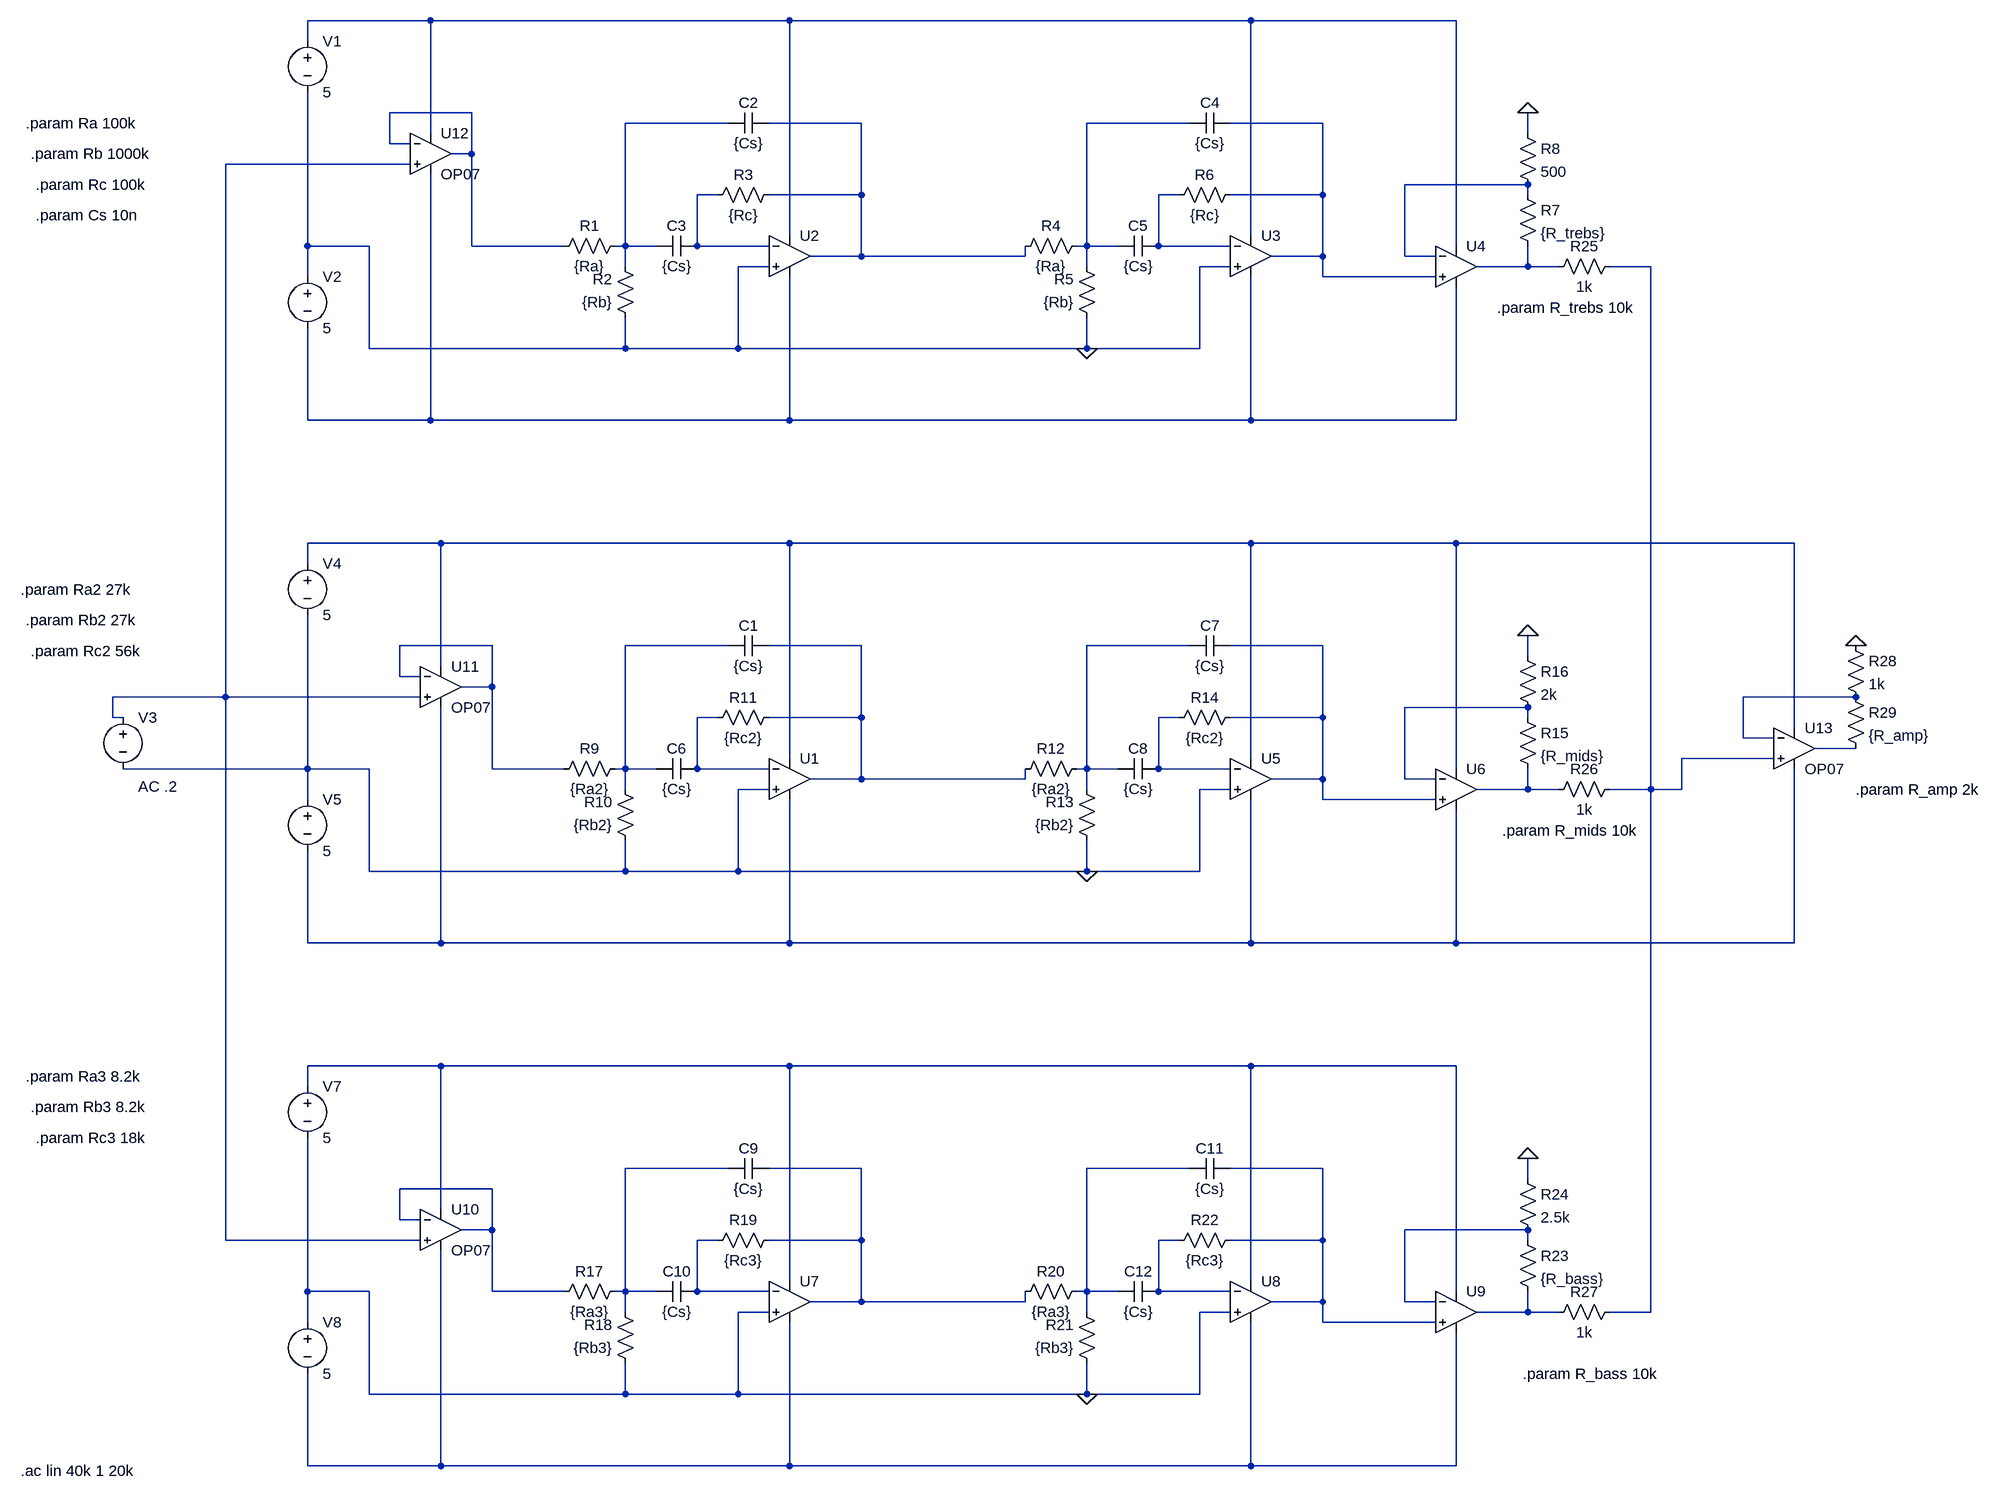
[diagram p0: schematic MFB_3_stages.asc]
MFB_3_stages.asc, the LTspice schematic file:
Version 4
SHEET 1 1616 2616
WIRE -816 320 -1008 320
WIRE -256 320 -816 320
WIRE 464 320 -256 320
WIRE 784 320 464 320
WIRE -1008 352 -1008 320
WIRE -752 464 -880 464
WIRE -352 480 -512 480
WIRE -144 480 -288 480
WIRE 368 480 208 480
WIRE 576 480 432 480
WIRE -816 496 -816 320
WIRE 896 496 896 464
WIRE -880 512 -880 464
WIRE -848 512 -880 512
WIRE -752 528 -752 464
WIRE -752 528 -784 528
WIRE -848 544 -1136 544
WIRE 896 576 704 576
WIRE -368 592 -400 592
WIRE -144 592 -144 480
WIRE -144 592 -288 592
WIRE 352 592 320 592
WIRE 576 592 576 480
WIRE 576 592 432 592
WIRE 896 592 896 576
WIRE -256 656 -256 320
WIRE 464 656 464 320
WIRE -1008 672 -1008 432
WIRE -912 672 -1008 672
WIRE -752 672 -752 528
WIRE -608 672 -752 672
WIRE -512 672 -512 480
WIRE -512 672 -528 672
WIRE -464 672 -512 672
WIRE -400 672 -400 592
WIRE -288 672 -400 672
WIRE 208 672 208 480
WIRE 208 672 192 672
WIRE 256 672 208 672
WIRE 320 672 320 592
WIRE 432 672 320 672
WIRE 784 672 784 320
WIRE -144 688 -144 592
WIRE -144 688 -224 688
WIRE 112 688 112 672
WIRE 112 688 -144 688
WIRE 576 688 576 592
WIRE 576 688 496 688
WIRE 704 688 704 576
WIRE 752 688 704 688
WIRE -512 704 -512 672
WIRE -288 704 -336 704
WIRE 208 704 208 672
WIRE 432 704 384 704
WIRE 896 704 896 672
WIRE 896 704 816 704
WIRE 944 704 896 704
WIRE 1088 704 1024 704
WIRE -1008 720 -1008 672
WIRE 576 720 576 688
WIRE 752 720 576 720
WIRE -912 832 -912 672
WIRE -512 832 -512 784
WIRE -512 832 -912 832
WIRE -336 832 -336 704
WIRE -336 832 -512 832
WIRE 208 832 208 784
WIRE 208 832 -336 832
WIRE 384 832 384 704
WIRE 384 832 208 832
WIRE -1008 944 -1008 800
WIRE -816 944 -816 560
WIRE -816 944 -1008 944
WIRE -256 944 -256 720
WIRE -256 944 -816 944
WIRE 464 944 464 720
WIRE 464 944 -256 944
WIRE 784 944 784 736
WIRE 784 944 464 944
WIRE -800 1136 -1008 1136
WIRE -256 1136 -800 1136
WIRE 464 1136 -256 1136
WIRE 784 1136 464 1136
WIRE 1312 1136 784 1136
WIRE -1008 1168 -1008 1136
WIRE -720 1296 -864 1296
WIRE -352 1296 -512 1296
WIRE -144 1296 -288 1296
WIRE 368 1296 208 1296
WIRE 576 1296 432 1296
WIRE 896 1312 896 1280
WIRE -800 1328 -800 1136
WIRE -864 1344 -864 1296
WIRE -832 1344 -864 1344
WIRE -720 1360 -720 1296
WIRE -720 1360 -768 1360
WIRE -1136 1376 -1136 544
WIRE -1136 1376 -1312 1376
WIRE -832 1376 -1136 1376
WIRE 1408 1376 1232 1376
WIRE 896 1392 704 1392
WIRE -1312 1408 -1312 1376
WIRE -1296 1408 -1312 1408
WIRE -368 1408 -400 1408
WIRE -144 1408 -144 1296
WIRE -144 1408 -288 1408
WIRE 352 1408 320 1408
WIRE 576 1408 576 1296
WIRE 576 1408 432 1408
WIRE 896 1408 896 1392
WIRE 1312 1424 1312 1136
WIRE 1232 1440 1232 1376
WIRE 1280 1440 1232 1440
WIRE 1408 1456 1344 1456
WIRE -256 1472 -256 1136
WIRE 464 1472 464 1136
WIRE 1280 1472 1136 1472
WIRE -1008 1488 -1008 1248
WIRE -1008 1488 -1296 1488
WIRE -912 1488 -1008 1488
WIRE -720 1488 -720 1360
WIRE -608 1488 -720 1488
WIRE -512 1488 -512 1296
WIRE -512 1488 -528 1488
WIRE -464 1488 -512 1488
WIRE -400 1488 -400 1408
WIRE -288 1488 -400 1488
WIRE 208 1488 208 1296
WIRE 208 1488 192 1488
WIRE 256 1488 208 1488
WIRE 320 1488 320 1408
WIRE 432 1488 320 1488
WIRE 784 1488 784 1136
WIRE -144 1504 -144 1408
WIRE -144 1504 -224 1504
WIRE 112 1504 112 1488
WIRE 112 1504 -144 1504
WIRE 576 1504 576 1408
WIRE 576 1504 496 1504
WIRE 704 1504 704 1392
WIRE 752 1504 704 1504
WIRE -512 1520 -512 1488
WIRE -288 1520 -336 1520
WIRE 208 1520 208 1488
WIRE 432 1520 384 1520
WIRE 896 1520 896 1488
WIRE 896 1520 816 1520
WIRE 944 1520 896 1520
WIRE 1088 1520 1088 704
WIRE 1088 1520 1024 1520
WIRE 1136 1520 1136 1472
WIRE 1136 1520 1088 1520
WIRE -1008 1536 -1008 1488
WIRE 576 1536 576 1504
WIRE 752 1536 576 1536
WIRE -912 1648 -912 1488
WIRE -512 1648 -512 1600
WIRE -512 1648 -912 1648
WIRE -336 1648 -336 1520
WIRE -336 1648 -512 1648
WIRE 208 1648 208 1600
WIRE 208 1648 -336 1648
WIRE 384 1648 384 1520
WIRE 384 1648 208 1648
WIRE -1008 1760 -1008 1616
WIRE -800 1760 -800 1392
WIRE -800 1760 -1008 1760
WIRE -256 1760 -256 1536
WIRE -256 1760 -800 1760
WIRE 464 1760 464 1536
WIRE 464 1760 -256 1760
WIRE 784 1760 784 1552
WIRE 784 1760 464 1760
WIRE 1312 1760 1312 1488
WIRE 1312 1760 784 1760
WIRE -800 1952 -1008 1952
WIRE -256 1952 -800 1952
WIRE 464 1952 -256 1952
WIRE 784 1952 464 1952
WIRE -1008 1984 -1008 1952
WIRE -352 2112 -512 2112
WIRE -144 2112 -288 2112
WIRE 368 2112 208 2112
WIRE 576 2112 432 2112
WIRE 896 2128 896 2096
WIRE -720 2144 -864 2144
WIRE -800 2176 -800 1952
WIRE -864 2192 -864 2144
WIRE -832 2192 -864 2192
WIRE -720 2208 -720 2144
WIRE -720 2208 -768 2208
WIRE 896 2208 704 2208
WIRE -1136 2224 -1136 1376
WIRE -832 2224 -1136 2224
WIRE -368 2224 -400 2224
WIRE -144 2224 -144 2112
WIRE -144 2224 -288 2224
WIRE 352 2224 320 2224
WIRE 576 2224 576 2112
WIRE 576 2224 432 2224
WIRE 896 2224 896 2208
WIRE -256 2288 -256 1952
WIRE 464 2288 464 1952
WIRE -1008 2304 -1008 2064
WIRE -912 2304 -1008 2304
WIRE -720 2304 -720 2208
WIRE -608 2304 -720 2304
WIRE -512 2304 -512 2112
WIRE -512 2304 -528 2304
WIRE -464 2304 -512 2304
WIRE -400 2304 -400 2224
WIRE -288 2304 -400 2304
WIRE 208 2304 208 2112
WIRE 208 2304 192 2304
WIRE 256 2304 208 2304
WIRE 320 2304 320 2224
WIRE 432 2304 320 2304
WIRE 784 2304 784 1952
WIRE -144 2320 -144 2224
WIRE -144 2320 -224 2320
WIRE 112 2320 112 2304
WIRE 112 2320 -144 2320
WIRE 576 2320 576 2224
WIRE 576 2320 496 2320
WIRE 704 2320 704 2208
WIRE 752 2320 704 2320
WIRE -512 2336 -512 2304
WIRE -288 2336 -336 2336
WIRE 208 2336 208 2304
WIRE 432 2336 384 2336
WIRE 896 2336 896 2304
WIRE 896 2336 816 2336
WIRE 944 2336 896 2336
WIRE 1088 2336 1088 1520
WIRE 1088 2336 1024 2336
WIRE -1008 2352 -1008 2304
WIRE 576 2352 576 2320
WIRE 752 2352 576 2352
WIRE -912 2464 -912 2304
WIRE -512 2464 -512 2416
WIRE -512 2464 -912 2464
WIRE -336 2464 -336 2336
WIRE -336 2464 -512 2464
WIRE 208 2464 208 2416
WIRE 208 2464 -336 2464
WIRE 384 2464 384 2336
WIRE 384 2464 208 2464
WIRE -1008 2576 -1008 2432
WIRE -800 2576 -800 2240
WIRE -800 2576 -1008 2576
WIRE -256 2576 -256 2352
WIRE -256 2576 -800 2576
WIRE 464 2576 464 2352
WIRE 464 2576 -256 2576
WIRE 784 2576 784 2368
WIRE 784 2576 464 2576
FLAG 896 464 0
FLAG 208 832 0
FLAG 896 1280 0
FLAG 208 1648 0
FLAG 896 2096 0
FLAG 208 2464 0
FLAG 1408 1296 0
DATAFLAG -144 704 ""
DATAFLAG -144 576 ""
DATAFLAG -144 592 ""
DATAFLAG -144 592 ""
DATAFLAG -144 1520 ""
DATAFLAG -144 1392 ""
DATAFLAG -144 1408 ""
DATAFLAG -144 1408 ""
DATAFLAG -144 2336 ""
DATAFLAG -144 2208 ""
DATAFLAG -144 2224 ""
DATAFLAG -144 2224 ""
SYMBOL res -512 656 R90
WINDOW 0 0 56 VBottom 2
WINDOW 3 32 56 VTop 2
SYMATTR InstName R1
SYMATTR Value {Ra}
SYMBOL res -496 800 R180
WINDOW 0 36 76 Left 2
WINDOW 3 36 40 Left 2
SYMATTR InstName R2
SYMATTR Value {Rb}
SYMBOL res -384 608 R270
WINDOW 0 32 56 VTop 2
WINDOW 3 0 56 VBottom 2
SYMATTR InstName R3
SYMATTR Value {Rc}
SYMBOL cap -288 464 R90
WINDOW 0 0 32 VBottom 2
WINDOW 3 32 32 VTop 2
SYMATTR InstName C2
SYMATTR Value {Cs}
SYMBOL cap -400 656 R90
WINDOW 0 0 32 VBottom 2
WINDOW 3 32 32 VTop 2
SYMATTR InstName C3
SYMATTR Value {Cs}
SYMBOL OpAmps\\UniversalOpAmp -256 688 R0
SYMATTR InstName U2
SYMBOL res 208 656 R90
WINDOW 0 0 56 VBottom 2
WINDOW 3 32 56 VTop 2
SYMATTR InstName R4
SYMATTR Value {Ra}
SYMBOL res 224 800 R180
WINDOW 0 36 76 Left 2
WINDOW 3 36 40 Left 2
SYMATTR InstName R5
SYMATTR Value {Rb}
SYMBOL res 336 608 R270
WINDOW 0 32 56 VTop 2
WINDOW 3 0 56 VBottom 2
SYMATTR InstName R6
SYMATTR Value {Rc}
SYMBOL cap 432 464 R90
WINDOW 0 0 32 VBottom 2
WINDOW 3 32 32 VTop 2
SYMATTR InstName C4
SYMATTR Value {Cs}
SYMBOL cap 320 656 R90
WINDOW 0 0 32 VBottom 2
WINDOW 3 32 32 VTop 2
SYMATTR InstName C5
SYMATTR Value {Cs}
SYMBOL OpAmps\\UniversalOpAmp 464 688 R0
SYMATTR InstName U3
SYMBOL OpAmps\\UniversalOpAmp 784 704 R0
SYMATTR InstName U4
SYMBOL res 880 576 R0
SYMATTR InstName R7
SYMATTR Value {R_trebs}
SYMBOL res 880 480 R0
SYMATTR InstName R8
SYMATTR Value 500
SYMBOL voltage -1008 336 R0
WINDOW 123 0 0 Left 0
WINDOW 39 0 0 Left 0
SYMATTR InstName V1
SYMATTR Value 5
SYMBOL voltage -1008 704 R0
WINDOW 123 0 0 Left 0
WINDOW 39 0 0 Left 0
SYMATTR InstName V2
SYMATTR Value 5
SYMBOL res -512 1472 R90
WINDOW 0 0 56 VBottom 2
WINDOW 3 32 56 VTop 2
SYMATTR InstName R9
SYMATTR Value {Ra2}
SYMBOL res -496 1616 R180
WINDOW 0 36 76 Left 2
WINDOW 3 36 40 Left 2
SYMATTR InstName R10
SYMATTR Value {Rb2}
SYMBOL res -384 1424 R270
WINDOW 0 32 56 VTop 2
WINDOW 3 0 56 VBottom 2
SYMATTR InstName R11
SYMATTR Value {Rc2}
SYMBOL cap -288 1280 R90
WINDOW 0 0 32 VBottom 2
WINDOW 3 32 32 VTop 2
SYMATTR InstName C1
SYMATTR Value {Cs}
SYMBOL cap -400 1472 R90
WINDOW 0 0 32 VBottom 2
WINDOW 3 32 32 VTop 2
SYMATTR InstName C6
SYMATTR Value {Cs}
SYMBOL OpAmps\\UniversalOpAmp -256 1504 R0
SYMATTR InstName U1
SYMBOL res 208 1472 R90
WINDOW 0 0 56 VBottom 2
WINDOW 3 32 56 VTop 2
SYMATTR InstName R12
SYMATTR Value {Ra2}
SYMBOL res 224 1616 R180
WINDOW 0 36 76 Left 2
WINDOW 3 36 40 Left 2
SYMATTR InstName R13
SYMATTR Value {Rb2}
SYMBOL res 336 1424 R270
WINDOW 0 32 56 VTop 2
WINDOW 3 0 56 VBottom 2
SYMATTR InstName R14
SYMATTR Value {Rc2}
SYMBOL cap 432 1280 R90
WINDOW 0 0 32 VBottom 2
WINDOW 3 32 32 VTop 2
SYMATTR InstName C7
SYMATTR Value {Cs}
SYMBOL cap 320 1472 R90
WINDOW 0 0 32 VBottom 2
WINDOW 3 32 32 VTop 2
SYMATTR InstName C8
SYMATTR Value {Cs}
SYMBOL OpAmps\\UniversalOpAmp 464 1504 R0
SYMATTR InstName U5
SYMBOL OpAmps\\UniversalOpAmp 784 1520 R0
SYMATTR InstName U6
SYMBOL res 880 1392 R0
SYMATTR InstName R15
SYMATTR Value {R_mids}
SYMBOL res 880 1296 R0
SYMATTR InstName R16
SYMATTR Value 2k
SYMBOL voltage -1008 1152 R0
WINDOW 123 0 0 Left 0
WINDOW 39 0 0 Left 0
SYMATTR InstName V4
SYMATTR Value 5
SYMBOL voltage -1008 1520 R0
WINDOW 123 0 0 Left 0
WINDOW 39 0 0 Left 0
SYMATTR InstName V5
SYMATTR Value 5
SYMBOL res -512 2288 R90
WINDOW 0 0 56 VBottom 2
WINDOW 3 32 56 VTop 2
SYMATTR InstName R17
SYMATTR Value {Ra3}
SYMBOL res -496 2432 R180
WINDOW 0 36 76 Left 2
WINDOW 3 36 40 Left 2
SYMATTR InstName R18
SYMATTR Value {Rb3}
SYMBOL res -384 2240 R270
WINDOW 0 32 56 VTop 2
WINDOW 3 0 56 VBottom 2
SYMATTR InstName R19
SYMATTR Value {Rc3}
SYMBOL cap -288 2096 R90
WINDOW 0 0 32 VBottom 2
WINDOW 3 32 32 VTop 2
SYMATTR InstName C9
SYMATTR Value {Cs}
SYMBOL cap -400 2288 R90
WINDOW 0 0 32 VBottom 2
WINDOW 3 32 32 VTop 2
SYMATTR InstName C10
SYMATTR Value {Cs}
SYMBOL OpAmps\\UniversalOpAmp -256 2320 R0
SYMATTR InstName U7
SYMBOL res 208 2288 R90
WINDOW 0 0 56 VBottom 2
WINDOW 3 32 56 VTop 2
SYMATTR InstName R20
SYMATTR Value {Ra3}
SYMBOL res 224 2432 R180
WINDOW 0 36 76 Left 2
WINDOW 3 36 40 Left 2
SYMATTR InstName R21
SYMATTR Value {Rb3}
SYMBOL res 336 2240 R270
WINDOW 0 32 56 VTop 2
WINDOW 3 0 56 VBottom 2
SYMATTR InstName R22
SYMATTR Value {Rc3}
SYMBOL cap 432 2096 R90
WINDOW 0 0 32 VBottom 2
WINDOW 3 32 32 VTop 2
SYMATTR InstName C11
SYMATTR Value {Cs}
SYMBOL cap 320 2288 R90
WINDOW 0 0 32 VBottom 2
WINDOW 3 32 32 VTop 2
SYMATTR InstName C12
SYMATTR Value {Cs}
SYMBOL OpAmps\\UniversalOpAmp 464 2320 R0
SYMATTR InstName U8
SYMBOL OpAmps\\UniversalOpAmp 784 2336 R0
SYMATTR InstName U9
SYMBOL res 880 2208 R0
SYMATTR InstName R23
SYMATTR Value {R_bass}
SYMBOL res 880 2112 R0
SYMATTR InstName R24
SYMATTR Value 2.5k
SYMBOL voltage -1008 1968 R0
WINDOW 123 0 0 Left 0
WINDOW 39 0 0 Left 0
SYMATTR InstName V7
SYMATTR Value 5
SYMBOL voltage -1008 2336 R0
WINDOW 123 0 0 Left 0
WINDOW 39 0 0 Left 0
SYMATTR InstName V8
SYMATTR Value 5
SYMBOL OpAmps\\OP07 -800 2144 R0
SYMATTR InstName U10
SYMBOL OpAmps\\OP07 -800 1296 R0
SYMATTR InstName U11
SYMBOL OpAmps\\OP07 -816 464 R0
SYMATTR InstName U12
SYMBOL voltage -1296 1392 R0
WINDOW 123 24 124 Left 2
WINDOW 39 0 0 Left 0
SYMATTR Value2 AC .2
SYMATTR InstName V3
SYMATTR Value ""
SYMBOL OpAmps\\OP07 1312 1392 R0
SYMATTR InstName U13
SYMBOL res 1040 688 R90
WINDOW 0 0 56 VBottom 2
WINDOW 3 32 56 VTop 2
SYMATTR InstName R25
SYMATTR Value 1k
SYMBOL res 1040 1504 R90
WINDOW 0 0 56 VBottom 2
WINDOW 3 32 56 VTop 2
SYMATTR InstName R26
SYMATTR Value 1k
SYMBOL res 1040 2320 R90
WINDOW 0 0 56 VBottom 2
WINDOW 3 32 56 VTop 2
SYMATTR InstName R27
SYMATTR Value 1k
SYMBOL res 1392 1280 R0
SYMATTR InstName R28
SYMATTR Value 1k
SYMBOL res 1392 1360 R0
SYMATTR InstName R29
SYMATTR Value {R_amp}
TEXT -1448 480 Left 2 !.param Ra 100k
TEXT -1440 528 Left 2 !.param Rb 1000k
TEXT -1432 576 Left 2 !.param Rc 100k
TEXT -1432 624 Left 2 !.param Cs 10n
TEXT -1456 1208 Left 2 !.param Ra2 27k
TEXT -1448 1256 Left 2 !.param Rb2 27k
TEXT -1440 1304 Left 2 !.param Rc2 56k
TEXT -1448 1968 Left 2 !.param Ra3 8.2k
TEXT -1440 2016 Left 2 !.param Rb3 8.2k
TEXT -1432 2064 Left 2 !.param Rc3 18k
TEXT 888 2432 Left 2 !.param R_bass 10k
TEXT 856 1584 Left 2 !.param R_mids 10k
TEXT 848 768 Left 2 !.param R_trebs 10k
TEXT -1456 2584 Left 2 !.ac lin 40k 1 20k
TEXT 1408 1520 Left 2 !.param R_amp 2k

The netlist it stands for:
* MFB_3_stages.asc
R1 N003 N002 {Ra}
R2 0 N003 {Rb}
R3 N009 N004 {Rc}
C2 N004 N003 {Cs}
C3 N009 N003 {Cs}
XU2 0 N009 N001 N013 N004 level1 Avol=1Meg GBW=10Meg Vos=0 En=0 Enk=0 In=0 Ink=0 Rin=500Meg  ; pins In+ In- V+ V- OUT
R4 N005 N004 {Ra}
R5 0 N005 {Rb}
R6 N010 N006 {Rc}
C4 N006 N005 {Cs}
C5 N010 N005 {Cs}
XU3 0 N010 N001 N013 N006 level1 Avol=1Meg GBW=10Meg Vos=0 En=0 Enk=0 In=0 Ink=0 Rin=500Meg  ; pins In+ In- V+ V- OUT
XU4 N006 N008 N001 N013 N011 level1 Avol=1Meg GBW=10Meg Vos=0 En=0 Enk=0 In=0 Ink=0 Rin=500Meg  ; pins In+ In- V+ V- OUT
R7 N008 N011 {R_trebs}
R8 0 N008 500
V1 N001 0 5
V2 0 N013 5
R9 N016 N015 {Ra2}
R10 0 N016 {Rb2}
R11 N022 N017 {Rc2}
C1 N017 N016 {Cs}
C6 N022 N016 {Cs}
XU1 0 N022 N014 N026 N017 level1 Avol=1Meg GBW=10Meg Vos=0 En=0 Enk=0 In=0 Ink=0 Rin=500Meg  ; pins In+ In- V+ V- OUT
R12 N018 N017 {Ra2}
R13 0 N018 {Rb2}
R14 N023 N019 {Rc2}
C7 N019 N018 {Cs}
C8 N023 N018 {Cs}
XU5 0 N023 N014 N026 N019 level1 Avol=1Meg GBW=10Meg Vos=0 En=0 Enk=0 In=0 Ink=0 Rin=500Meg  ; pins In+ In- V+ V- OUT
XU6 N019 N021 N014 N026 N025 level1 Avol=1Meg GBW=10Meg Vos=0 En=0 Enk=0 In=0 Ink=0 Rin=500Meg  ; pins In+ In- V+ V- OUT
R15 N021 N025 {R_mids}
R16 0 N021 2k
V4 N014 0 5
V5 0 N026 5
R17 N028 N032 {Ra3}
R18 0 N028 {Rb3}
R19 N034 N029 {Rc3}
C9 N029 N028 {Cs}
C10 N034 N028 {Cs}
XU7 0 N034 N027 N037 N029 level1 Avol=1Meg GBW=10Meg Vos=0 En=0 Enk=0 In=0 Ink=0 Rin=500Meg  ; pins In+ In- V+ V- OUT
R20 N030 N029 {Ra3}
R21 0 N030 {Rb3}
R22 N035 N031 {Rc3}
C11 N031 N030 {Cs}
C12 N035 N030 {Cs}
XU8 0 N035 N027 N037 N031 level1 Avol=1Meg GBW=10Meg Vos=0 En=0 Enk=0 In=0 Ink=0 Rin=500Meg  ; pins In+ In- V+ V- OUT
XU9 N031 N033 N027 N037 N036 level1 Avol=1Meg GBW=10Meg Vos=0 En=0 Enk=0 In=0 Ink=0 Rin=500Meg  ; pins In+ In- V+ V- OUT
R23 N033 N036 {R_bass}
R24 0 N033 2.5k
V7 N027 0 5
V8 0 N037 5
XU10 N007 N032 N027 N037 N032 LT1001  ; OP07, pins In+ In- V+ V- OUT
XU11 N007 N015 N014 N026 N015 LT1001  ; OP07, pins In+ In- V+ V- OUT
XU12 N007 N002 N001 N013 N002 LT1001  ; OP07, pins In+ In- V+ V- OUT
V3 N007 0 AC .2
XU13 N012 N020 N014 N026 N024 LT1001  ; OP07, pins In+ In- V+ V- OUT
R25 N012 N011 1k
R26 N012 N025 1k
R27 N012 N036 1k
R28 0 N020 1k
R29 N020 N024 {R_amp}
.param Ra 100k
.param Rb 1000k
.param Rc 100k
.param Cs 10n
.param Ra2 27k
.param Rb2 27k
.param Rc2 56k
.param Ra3 8.2k
.param Rb3 8.2k
.param Rc3 18k
.param R_bass 10k
.param R_mids 10k
.param R_trebs 10k
.ac lin 40k 1 20k
.param R_amp 2k
.lib UniversalOpAmp1.lib
.lib LTC.lib
.backanno
.end